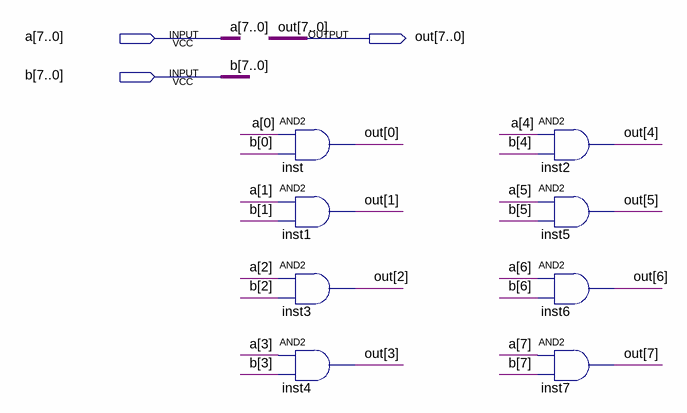
[diagram p0: schematic sheet]
// Quartus schematic and_gate.bdf as structural Verilog: 8 symbols, 3 pins
module and_gate (
  input  [7:0] a,
  input  [7:0] b,
  output [7:0] out
);

  and inst (out[0], a[0], b[0]);
  and inst1 (out[1], a[1], b[1]);
  and inst3 (out[2], a[2], b[2]);
  and inst4 (out[3], a[3], b[3]);
  and inst2 (out[4], a[4], b[4]);
  and inst5 (out[5], a[5], b[5]);
  and inst6 (out[6], a[6], b[6]);
  and inst7 (out[7], a[7], b[7]);
endmodule
